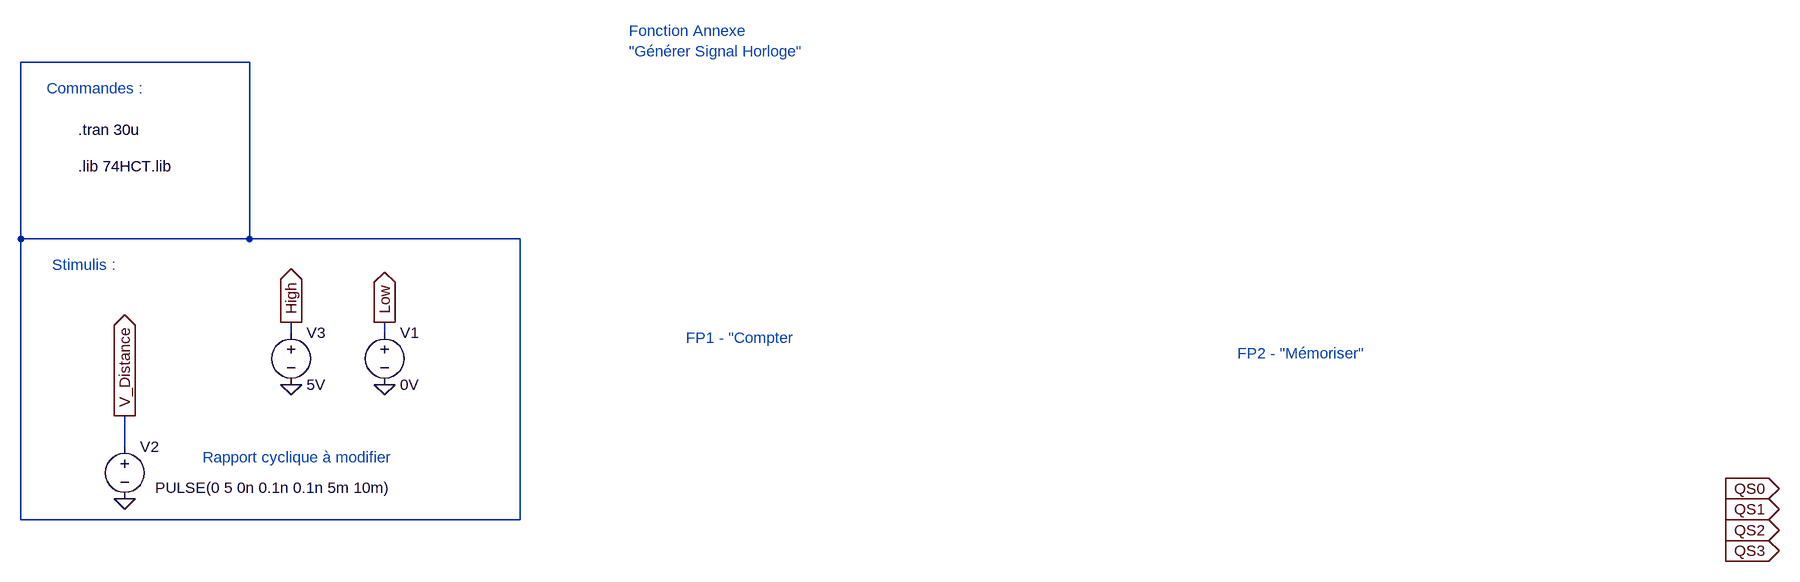
[diagram p0: schematic Démarche-1-squelette.asc]
Démarche-1-squelette.asc, the LTspice schematic file:
Version 4
SHEET 1 1924 1116
WIRE -432 -304 -784 -304
WIRE -784 -32 -784 -304
WIRE -432 -32 -432 -304
WIRE -432 -32 -784 -32
WIRE -16 -32 -432 -32
WIRE -368 112 -368 96
WIRE -224 112 -224 96
WIRE -624 288 -624 240
WIRE -784 400 -784 -32
WIRE -16 400 -16 -32
WIRE -16 400 -784 400
FLAG -368 192 0
FLAG -224 192 0
FLAG -624 368 0
FLAG -624 240 V_Distance
IOPIN -624 240 Out
FLAG -224 96 Low
IOPIN -224 96 Out
FLAG -368 96 High
IOPIN -368 96 Out
FLAG 1840 352 QS0
IOPIN 1840 352 Out
FLAG 1840 384 QS1
IOPIN 1840 384 Out
FLAG 1840 416 QS2
IOPIN 1840 416 Out
FLAG 1840 448 QS3
IOPIN 1840 448 Out
SYMBOL voltage -224 96 R0
WINDOW 123 0 0 Left 0
WINDOW 39 0 0 Left 0
SYMATTR InstName V1
SYMATTR Value 0V
SYMBOL voltage -624 272 R0
WINDOW 123 0 0 Left 0
WINDOW 39 0 0 Left 0
WINDOW 3 47 79 Left 2
SYMATTR Value PULSE(0 5 0n 0.1n 0.1n 5m 10m)
SYMATTR InstName V2
SYMBOL voltage -368 96 R0
WINDOW 123 0 0 Left 0
WINDOW 39 0 0 Left 0
SYMATTR InstName V3
SYMATTR Value 5V
TEXT -696 -200 Left 2 !.tran 30u
TEXT -696 -144 Left 2 !.lib 74HCT.lib
TEXT -504 304 Left 2 ;Rapport cyclique à modifier
TEXT 152 -352 Left 2 ;Fonction Annexe \n"Générer Signal Horloge"
TEXT 240 120 Left 2 ;FP1 - "Compter
TEXT 1088 144 Left 2 ;FP2 - "Mémoriser"
TEXT -736 8 Left 2 ;Stimulis :
TEXT -744 -264 Left 2 ;Commandes :

The netlist it stands for:
* Démarche-1-squelette.asc
V1 Low 0 0V
V2 V_Distance 0 PULSE(0 5 0n 0.1n 0.1n 5m 10m)
V3 High 0 5V
.tran 30u
.lib 74HCT.lib
* Rapport cyclique à modifier
* Fonction Annexe
* "Générer Signal Horloge"
* FP1 - "Compter
* FP2 - "Mémoriser"
* Stimulis :
* Commandes :
.backanno
.end